# EAGLE schematic v1 (EAGLE 6.4)
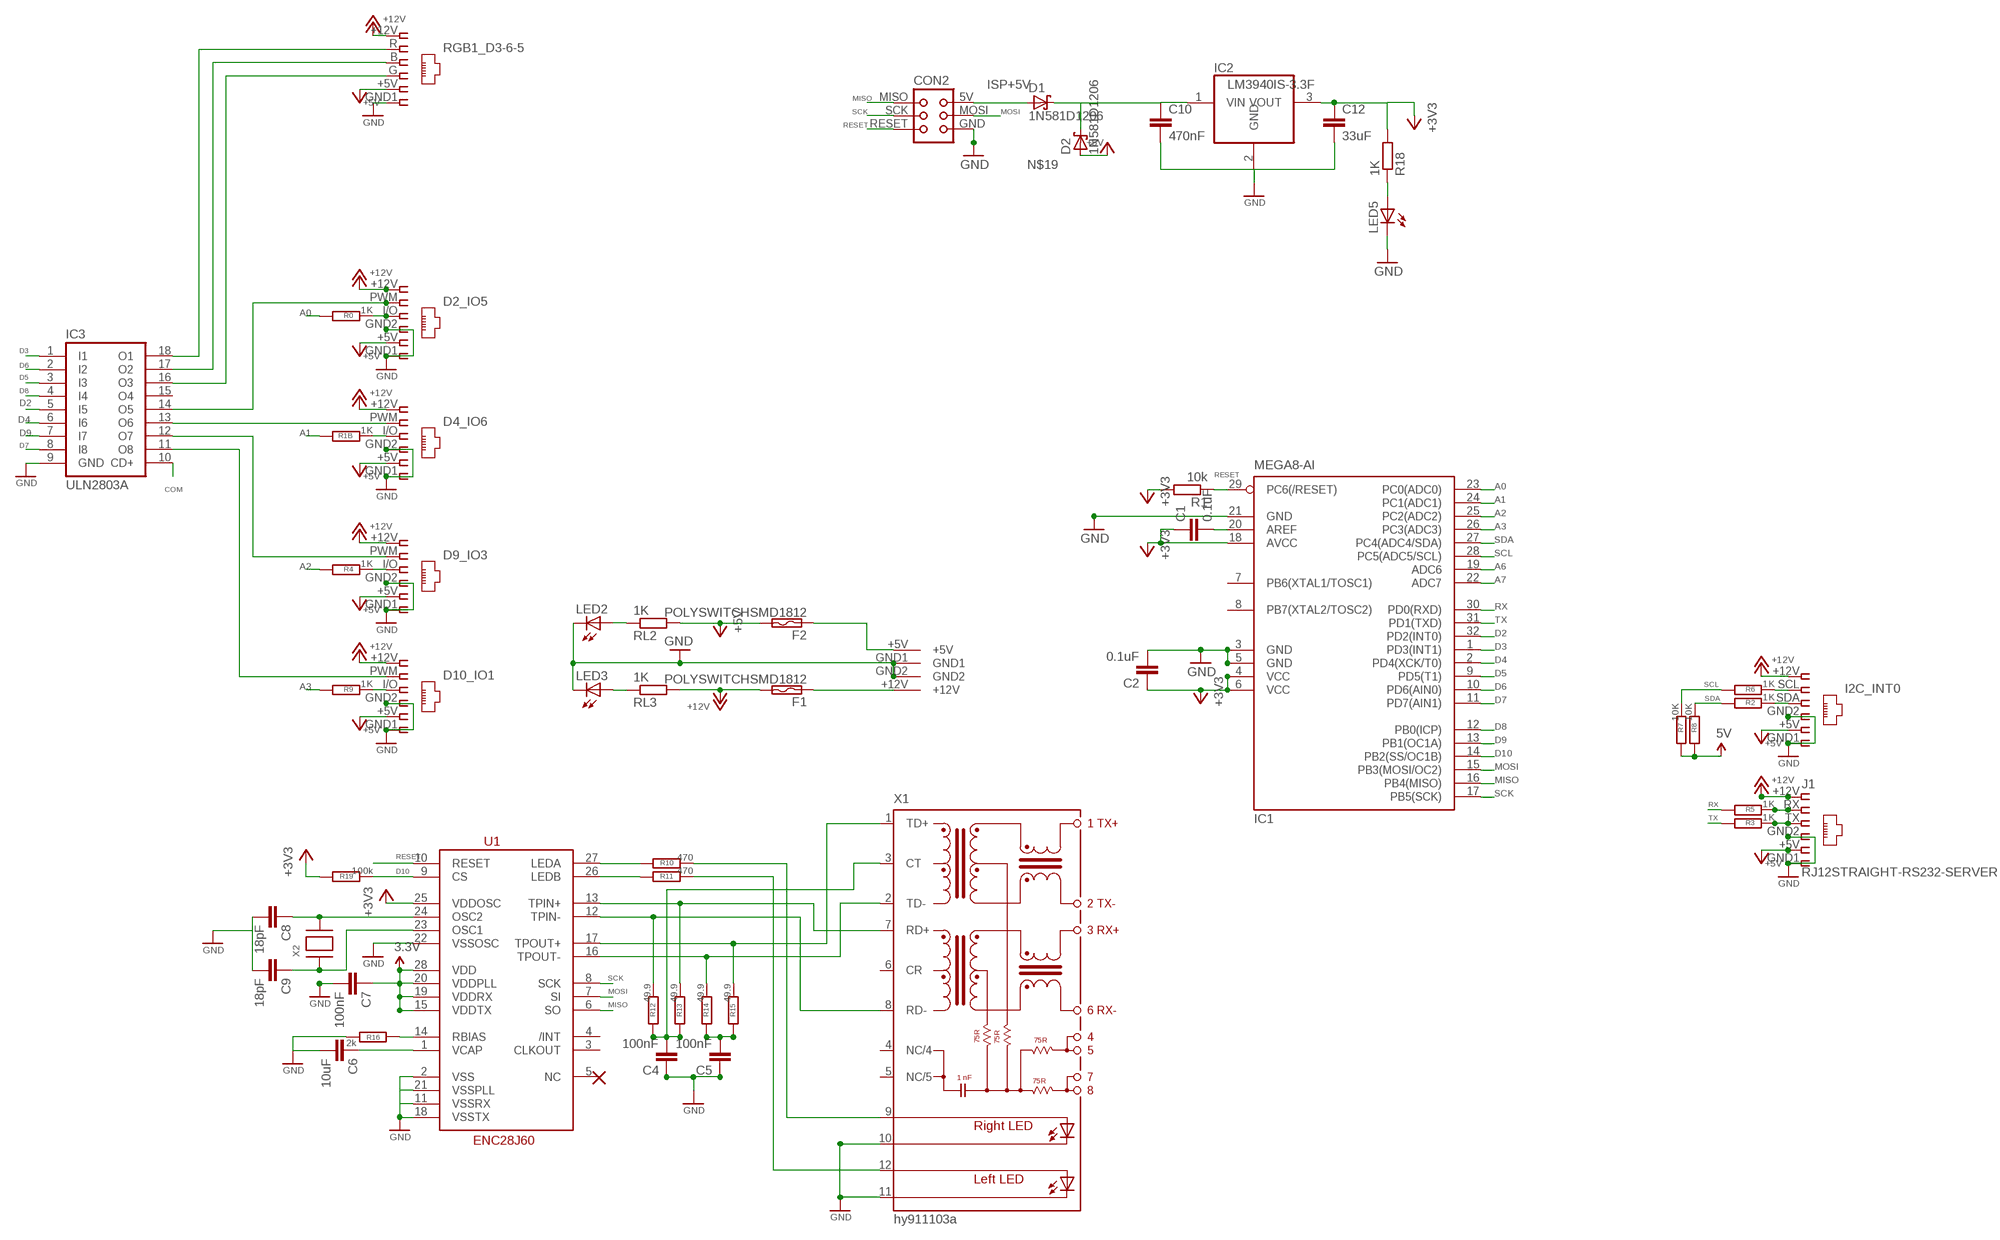
[diagram p0: schematic, sheet 1]

## Parts
C1  0.1uF  C-EUC1206  [C1206]
C2  0.1uF  C-EUC1206  [C1206]
C4  100nF  C-EUC1206  [C1206]
C5  100nF  C-EUC1206  [C1206]
C6  10uF  C-EUC1206  [C1206]
C7  100nF  C-EUC1206  [C1206]
C8  18pF  C-EUC1206  [C1206]
C9  18pF  C-EUC1206  [C1206]
C10  470nF  C-EUC1206  [C1206]
C12  33uF  CAP1210  [1210]
CON2  TINYISPTAG  [TC2030-MCP]
D1  1N581D1206  [LED-1206]
D2  1N581D1206  [LED-1206]
D2_IO5  IO5  RJ12STRAIGHT  [RJ12-STRAIGHT]
D4_IO6  IO6  RJ12STRAIGHT  [RJ12-STRAIGHT]
D9_IO3  IO3  RJ12STRAIGHT  [RJ12-STRAIGHT]
D10_IO1  IO1  RJ12STRAIGHT  [RJ12-STRAIGHT]
F1  POLYSWITCHSMD1812  [C1812]
F2  POLYSWITCHSMD1812  [C1812]
I2C_INT0  I2C  RJ12STRAIGHT-I2C  [RJ12-STRAIGHT-I2C]
IC1  MEGA8-AI  [TQFP32-08]
IC2  LM3940IS-3.3F  [DD-3]
IC3  ULN2803A  [SO18W]
J1  RJ12STRAIGHT-RS232-SERVER  [RJ12-STRAIGHT-RS232]
LED2  LED3MM  [LED3MM]
LED3  LED3MM  [LED3MM]
LED5  LED3MM  [LED3MM]
R0  1K  R-EU_M1206  [M1206]
R1  10k  R-EU_M1206  [M1206]
R1B  1K  R-EU_M1206  [M1206]
R2  1K  R-EU_M1206  [M1206]
R3  1K  R-EU_M1206  [M1206]
R4  1K  R-EU_M1206  [M1206]
R5  1K  R-EU_M1206  [M1206]
R6  1K  R-EU_M1206  [M1206]
R7  10K  R-EU_M1206  [M1206]
R8  10K  R-EU_M1206  [M1206]
R9  1K  R-EU_M1206  [M1206]
R10  470  R-EU_M1206  [M1206]
R11  470  R-EU_M1206  [M1206]
R12  49.9  R-EU_M1206  [M1206]
R13  49.9  R-EU_M1206  [M1206]
R14  49.9  R-EU_M1206  [M1206]
R15  49.9  R-EU_M1206  [M1206]
R16  2k  R-EU_M1206  [M1206]
R18  1K  R-EU_M1206  [M1206]
R19  100k  R-EU_M1206  [M1206]
RGB1_D3-6-5  RGB1  RJ12STRAIGHT-RGB  [RJ12-STRAIGHT-RGB]
RL2  1K  R-EU_M1206  [M1206]
RL3  1K  R-EU_M1206  [M1206]
U1  ENC28J60SO  [SO28W]
U$2  KPJX-4S-S  [KPJX-4S-S]
X1  hy911103a  J1011F01P  [J1]
X2  XTALNX5032  [NX5032]

## Nets
3.3V: C7.1 U1.15(VDDTX) U1.19(VDDRX) U1.20(VDDPLL) U1.28(VDD)
5V [power]: R7.2 R8.2
+3V3 [power]: C1.1 C2.1 C12.1 IC1.4(VCC) IC1.6(VCC) IC1.18(AVCC) IC2.3(VOUT) R1.2 R18.2 R19.2 U1.25(VDDOSC)
+5V: D2.A D2_IO5.+5V D4_IO6.+5V D9_IO3.+5V D10_IO1.+5V F2.2 I2C_INT0.+5V J1.+5V RGB1_D3-6-5.+5V RL2.2
+12V [highpower]: D2_IO5.+12V D4_IO6.+12V D9_IO3.+12V D10_IO1.+12V F1.2 I2C_INT0.+12V J1.+12V RGB1_D3-6-5.+12V RL3.2
A0: IC1.23(PC0(ADC0)) R0.2
A1 [fine]: IC1.24(PC1(ADC1)) R1B.2
A2 [fine]: IC1.25(PC2(ADC2)) R4.2
A3 [fine]: IC1.26(PC3(ADC3)) R9.2
A6: IC1.19(ADC6)
A7: IC1.22(ADC7)
COM: IC3.10(CD+)
D2: IC1.32(PD2(INT0)) IC3.5(I5)
D2B: D9_IO3.I/O R4.1
D2B1: D10_IO1.I/O R9.1
D2B4: I2C_INT0.SDA R2.1
D2B5: J1.TX R3.1
D2B6: D2_IO5.I/O R0.1
D2B7: D4_IO6.I/O R1B.1
D3: IC1.1(PD3(INT1)) IC3.1(I1)
D4: IC1.2(PD4(XCK/T0)) IC3.6(I6)
D5: IC1.9(PD5(T1)) IC3.3(I3)
D6: IC1.10(PD6(AIN0)) IC3.2(I2)
D7: IC1.11(PD7(AIN1)) IC3.8(I8)
D8: IC1.12(PB0(ICP)) IC3.4(I4)
D9: IC1.13(PB1(OC1A)) IC3.7(I7)
D10: IC1.14(PB2(SS/OC1B)) R19.1 U1.9(CS)
GND [power]: C2.2 C4.1 C5.1 C6.2 C7.2 C8.2 C9.2 C10.2 C12.2 CON2.GND D2_IO5.GND1 D2_IO5.GND2 D4_IO6.GND1 D4_IO6.GND2 D9_IO3.GND1 D9_IO3.GND2 D10_IO1.GND1 D10_IO1.GND2 I2C_INT0.GND1 I2C_INT0.GND2 IC1.3(GND) IC1.5(GND) IC1.21(GND) IC2.2(GND) IC3.9(GND) J1.GND1 J1.GND2 LED2.K(C) LED3.K(C) LED5.K(C) R16.1 RGB1_D3-6-5.GND1 U1.2(VSS) U1.11(VSSRX) U1.18(VSSTX) U1.21(VSSPLL) U1.22(VSSOSC) U$2.GND1 U$2.GND2 X1.10(C-R) X1.11(C-L)
ISP+5V: CON2.5V(VCC) D1.A
MISO [fine]: CON2.MISO IC1.16(PB4(MISO)) U1.6(SO)
MOSI [fine]: CON2.MOSI IC1.15(PB3(MOSI/OC2)) U1.7(SI)
N$1 [power]: IC3.16(O3) RGB1_D3-6-5.G
N$2: D4_IO6.PWM IC3.13(O6)
N$4: C1.2 IC1.20(AREF)
N$5: LED5.A R18.1
N$6: F2.1 U$2.+5V
N$8: F1.1 U$2.+12V
N$9 [fine]: R10.2 U1.27(LEDA)
N$10 [fine]: R11.2 U1.26(LEDB)
N$11: R10.1 X1.9(A-R)
N$12: R11.1 X1.12(AL)
N$13 [fine]: R15.1 U1.17(TPOUT+) X1.1(TD+)
N$14 [fine]: R14.1 U1.16(TPOUT-) X1.2(TD-)
N$15 [fine]: R13.1 U1.13(TPIN+) X1.7(RD+)
N$16 [fine]: R12.1 U1.12(TPIN-) X1.8(RD-)
N$17 [fine]: C4.2 R12.2 R13.2 X1.3(CT)
N$18 [fine]: C5.2 R14.2 R15.2
N$19 [power]: C10.1 D1.C D2.C IC2.1(VIN)
N$22 [power]: D9_IO3.PWM IC3.12(O7)
N$26 [fine]: C6.1 U1.1(VCAP)
N$27 [fine]: R16.2 U1.14(RBIAS)
N$28 [fine]: C9.1 U1.23(OSC1) X2.P$1
N$29 [fine]: C8.1 U1.24(OSC2) X2.P$2
N$50 [power]: IC3.17(O2) RGB1_D3-6-5.B
N$51 [power]: D10_IO1.PWM IC3.11(O8)
N$60 [power]: D2_IO5.PWM IC3.14(O5)
N$68 [power]: IC3.18(O1) RGB1_D3-6-5.R
N$70: J1.RX R5.1
N$71: I2C_INT0.SCL R6.1
N$75: LED3.A RL3.1
N$76: LED2.A RL2.1
RESET [fine]: CON2.RESET IC1.29(PC6(/RESET)) R1.1 U1.10(RESET)
RX: IC1.30(PD0(RXD)) R5.2
SCK [fine]: CON2.SCK IC1.17(PB5(SCK)) U1.8(SCK)
SCL: IC1.28(PC5(ADC5/SCL)) R6.2 R7.1
SDA: IC1.27(PC4(ADC4/SDA)) R2.2 R8.1
TX: IC1.31(PD1(TXD)) R3.2
Unconnected: IC1.7(PB6(XTAL1/TOSC1)) IC1.8(PB7(XTAL2/TOSC2)) IC3.15(O4) U1.3(CLKOUT) U1.4(/INT) U1.5(NC) X1.4(NC/4) X1.5(NC/5) X1.6(CR)

## Library data of the parts
C1 C2 C4-C9 = resistor:C-EU: CAPACITOR, European symbol
C10 = rcl:C-EU: CAPACITOR, European symbol
C12 = SparkFun:CAP: Capacitor Standard 0603 ceramic capacitor, and 0.1" leaded capacitor.
CON2 = lpatiny:TINYISP: CONNECTOR
D1 D2 = lpatiny:1N581*: 1.0A SCHOTTKY BARRIER RECTIFIER Source: http://www.diodes.com/datasheets/ds23001.pdf
D2_IO5 D4_IO6 D9_IO3 D10_IO1 I2C_INT0 J1 RGB1_D3-6-5 = lpatiny:RJ12: CORCOM Modular RJ Jacks No Shield Source: www.tycoelectronics.com .. ENG_DS_1654001_1099_RJ_L_0507.pdf
F1 F2 = lpatiny:POLYSWITCH: PolySwitch (TM) Resettable Device Source: Data sheet <http://www.farnell.com/datasheets/13482.pdf>
IC1 = atmel:MEGA8: MICROCONTROLLER 8 Kbytes FLASH, 1 kbytes SRAM, 512 bytes EEPROM, USART, 6-channel 10 bit ADC, 2-channel 8 bit ADC Pin compatible with Atmega48, ATMega88, ATMega168 Source: avr.lbr; MPN: ATMEGA8-16AU; OC_FARNELL: 9171371; OC_NEWARK: 73M8863
IC2 = lpatiny:LM3940IS-3.3: 1A Low Dropout (LDO) for 5V to 3.3V conversion; MF: TEXAS INSTRUMENTS; MPN: REG1117FAKTTT; OC_FARNELL: 1296120; OC_NEWARK: 87H2562
IC3 = lpatiny:ULN2803A: DRIVER ARRAY
LED2 LED3 LED5 = lpatiny:LED3MM
R0 R1 R1B R2-R16 R18 R19 RL2 RL3 = resistor:R-EU_: RESISTOR, European symbol
U1 = lpatiny:ENC28J60
U$2 = lpatiny:KPJX-4S-S
X1 = con-pulse:J1011F: PULSEJACK (TM) 1x1 Tab-UP RJ45 10/100 Base-TX RJ45 1x1 Tab-UP with LEDs 8-pin (J1 series) and 6-pin (JP series) integrated magnetics connector, designed to support applications, such as ADSL modems, LAN-on-Motherboard, and Hub and Switches. Source: www.pulseeng.com .. PulseJack-J402.pdf; OC_FARNELL: unknown; OC_NEWARK: unknown
X2 = adafruit:XTAL: Low cost SMT crystals, no capacitors included http://www.ladyada.net/library/eagle

## Net classes
0 default: width 0.457 mm
1 power: width 0.457 mm
2 highpower: width 0.914 mm
3 fine: width 0.203 mm